# EAGLE design SurfaceEEG_E_V1.1 (EAGLE 7.5.0)
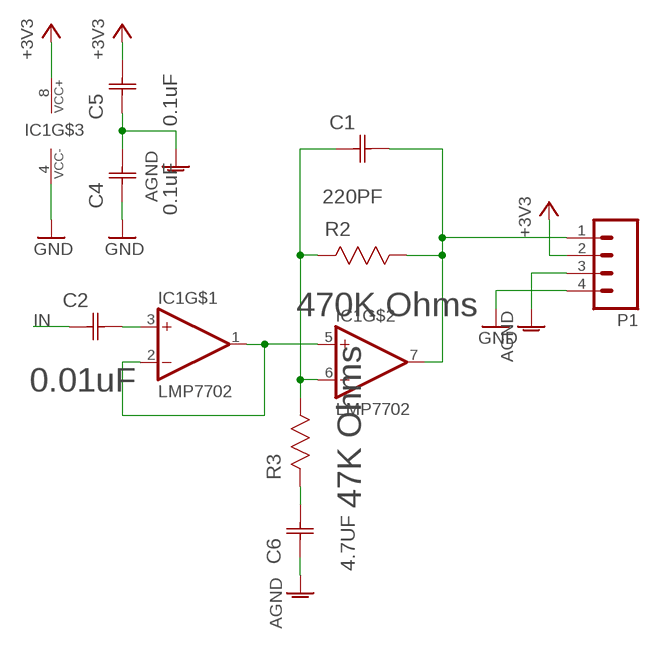
[diagram p0: schematic, sheet 1]

## Parts
C1  220PF  0603ZC221KAT2A  [CAPC1608X90N]
C2  0.01uF  C0402C103J3RACTU  [CAPC1005X60N]
C4  0.1uF  04023C104KAT2A  [CAPC1005X60N]
C5  0.1uF  04023C104KAT2A  [CAPC1005X60N]
C6  4.7UF  06036D475MAT2A  [CAPC1608X90N]
IC1  LMP7702  [VSSOP8]
P1  M04SMD  [1X04-SMD]
R2  470K Ohms  RC0603FR-07470KL  [RESC1608X60N]
R3  47K Ohms  RC0603FR-0747KL  [RESC1608X60N]

## Nets
+3V3: C5.1(C2) IC1.8(VCC+) P1.2
AGND: C4.1(C2) C5.2(C1) C6.1(C1) P1.3
GND: C4.2(C1) IC1.4(VCC-) P1.4
IN: C2.1(C1)
N$1: C2.2(C2) IC1.3(IN+)
N$2: C1.2(C2) IC1.7(OUT) P1.1 R2.1(R1)
N$4: C1.1(C1) IC1.6(IN-) R2.2(R2) R3.1(R1)
N$6: C6.2(C2) R3.2(R2)
SHIELD: IC1.1(OUT) IC1.2(IN-) IC1.5(IN+)

## Library data of the parts
C1 = (manufact)-capacitors-AVX-element14:0603ZC221KAT2A: Capacitor, 0603; MPN: 0603ZC221KAT2A; OC_FARNELL: -; OC_NEWARK: 41J1779; SUPPLIER: AVX; TOLERANCE: ±10%; VOLTAGERATING: 10V
C2 = (manufact)-Kemet-element14:C0402C103J3RACTU: CAPACITOR, 0402; MPN: C0402C103J3RACTU; OC_FARNELL: 1692285; OC_NEWARK: 78H4779; SUPPLIER: Kemet; TOLERANCE: ±5%; VOLTAGERATING: 25V
C4 C5 = (manufact)-capacitors-AVX-element14:04023C104KAT2A: Capacitor 0402; MPN: 04023C104KAT2A; OC_FARNELL: 1867948; OC_NEWARK: 37T9047; SUPPLIER: AVX; TOLERANCE: ±10%; VOLTAGERATING: 25V
C6 = (manufact)-capacitors-AVX-element14:06036D475MAT2A: Capacitor, 0603; MPN: 06036D475MAT2A; OC_FARNELL: 1740638; OC_NEWARK: 96M1296; SUPPLIER: AVX; TOLERANCE: ±20%; VOLTAGERATING: 6.3V
IC1 = (custom)-new-components:LMP7702: The library has been designed by Richard Magdycz <https://www.facebook.com/groups/eaglecadsoftUK>; MPN: LMP7702MM/NOPB
P1 = SparkFun-Connectors:M04: Header 4 Standard 4-pin 0.1" header. Use with straight break away headers (SKU : PRT-00116), right angle break away headers (PRT-00553), swiss pins (PRT-00743), machine pins (PRT-00117), and female headers (PRT-00115). Molex polarized connector foot print use with SKU : PRT-08231 with associated crimp pins and housings. 1MM SMD Version SKU: PRT-10208
R2 = (manufact)-resistors-YAGEO-element14:RC0603FR-07470KL: RESISTOR, 0603; MPN: RC0603FR-07470KL; OC_FARNELL: 1117267; OC_NEWARK: 68R0098; SUPPLIER: Yageo; TOLERANCE: ±1%; WATTAGE: 1/10 W
R3 = (manufact)-resistors-YAGEO-element14:RC0603FR-0747KL: RESISTOR, 0603; MPN: RC0603FR-0747KL; OC_FARNELL: 1117266; OC_NEWARK: 26M6759; SUPPLIER: Yageo; TOLERANCE: ±1%; WATTAGE: 1/10 W

## Board
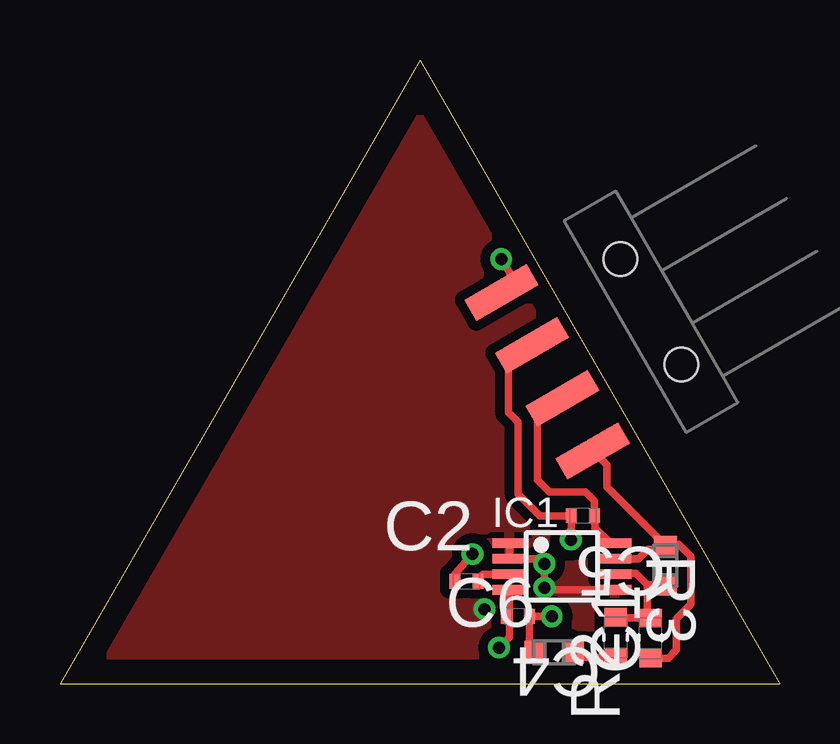
[diagram p1: board, top side]
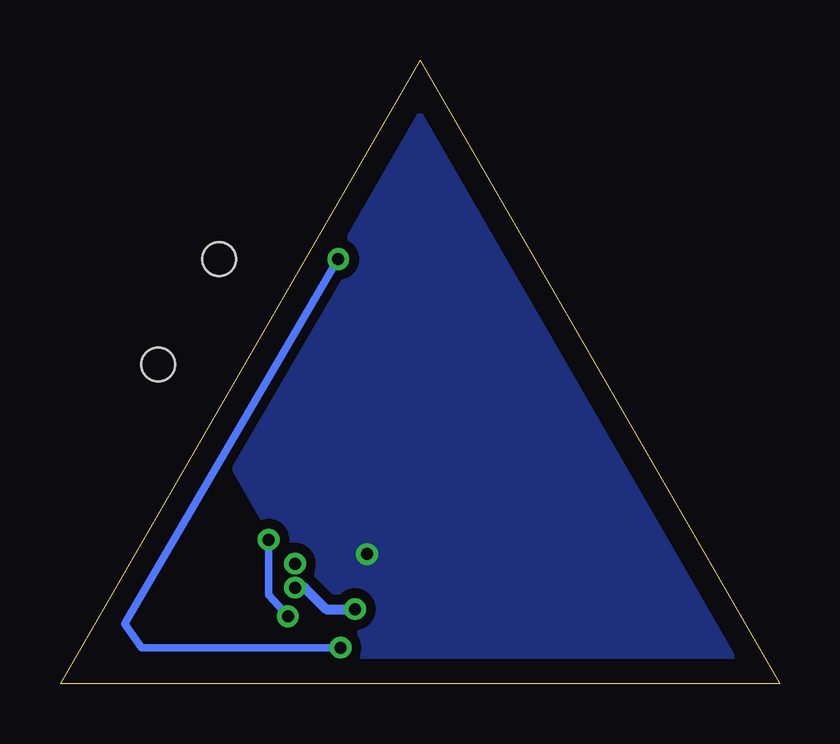
[diagram p2: board, bottom side, seen from below]

Size 30 x 26 mm. Coordinates in mm from the lower left corner, seen from the top.
Outline: 0,0 30,0 15,26 0,0
Copper layers (1*16): Top 0.035mm / dielectric 1.5mm / Bottom 0.035mm
Design rules "default": minimum track width 10mil, minimum drill 24mil, track to track 8mil, track to pad 8mil, pad to pad 8mil, via to via 8mil, smd to smd 8mil, copper to edge 40mil, drill to drill 8mil, minimum pad ring 10mil, minimum via ring 8mil, stop-mask expansion 4mil, vias tented up to drill 0mil, thermal gap 10mil

### Footprints (pad centres in the part's own frame; a part is rotated, then mirrored left to right if it is on the bottom)
CAPC1608X90N = smd 0.864 x 0.965: 1 -0.813,0; 2 0.813,0
CAPC1005X60N = smd 0.457 x 0.61: 1 -0.483,0; 2 0.483,0
VSSOP8 = smd 1.4 x 0.4: 1 -2.2,0.975; 2 -2.2,0.325; 3 -2.2,-0.325; 4 -2.2,-0.975; 5 2.2,-0.975; 6 2.2,-0.325; 7 2.2,0.325; 8 2.2,0.975
1X04-SMD = smd 1 x 3: 1 -3.81,5; 2 -1.27,5; 3 1.27,5; 4 3.81,5 | hole 1.4: -2.54,0; 2.54,0
RESC1608X60N = smd 0.762 x 0.94: 1 -0.838,0; 2 0.838,0

### Placement (x,y rotation side)
C1  25.24,4.92 90 top
C2  16.95,4.26 0 top
C4  19.1,2.8 180 top
C5  21.8,7 180 top
C6  20.6,1.3 0 top
IC1  20.93,4.88 0 top
P1  24.64,15.5 120 top
R2  24.62,1.9 90 top
R3  23.17,1.93 270 top

### Tracks (layer width: path | path; a pad name or v marks a point on that pad's centre or on a via)
+3V3
  Top 0.305: IC1.8 23.11,5.84 22.96,5.84 22.3,6.5 22.3,6.98 C5.1 22.28,7.62 21.9,8 20.4,8 19.9,8.5 19.9,10.86 P1.2
AGND  (via drill 0.5 pad 0.3)
  Top 0.305: v20.5,2.8 C4.1 19.58,1.71 C6.1 | v21.3,6 C5.2 20,7 19.1,7.9 19.1,10.9 18.7,11.3 18.7,13.12 P1.3
  Bottom 0.305: v20.5,2.8 21.3,3.7 v21.3,6
GND  (via drill 0.5 pad 0.3)
  Top 0.305: 18.6,2.68 C4.2 18.59,2.73 18.59,3.76 IC1.4 18.73,1.93 v18.3,1.5 | v18.4,17.7 19,16.7 P1.4
  Bottom 0.305: v18.3,1.5 26.6,1.5 27.3,2.5 v18.4,17.7
IN  (via drill 0.5 pad 0.3)
  Top 0.305: C2.1 16.47,4.57 v17.2,5.4 17.23,5.37 17.17,5.37
  pour Bottom (isolate 0.406): 15,24.7 1.1,0.6 17.9,0.6 23.4,10.2
N$1
  Top 0.305: IC1.3 17.63,4.55 C2.2
N$2
  Top 0.305: C1.2 | IC1.7 24.11,5.21 24.5,5.6 25.11,5.6 C1.2 | R2.1 25.36,1.06 25.7,1.4 25.7,2.7 26.3,3.3 26.3,5.3 25.8,5.8 25.31,5.8 | 25.31,5.8 C1.2 | 25.31,5.8 25.2,5.8 22.8,8.2 22.8,9.12 P1.1
N$4
  Top 0.305: 23.22,4.57 IC1.6 23.18,4.6 24,4.6 24.49,4.11 | C1.1 24.49,4.11 | 24.49,4.11 24.49,2.77 R2.2 23.2,2.74 R3.1
N$5  (via drill 0.5 pad 0.3)
  other vias: 20.2,5
N$6
  Top 0.305: R3.2 21.84,1.09 21.84,1.1 C6.2 21.3,1.7
SHIELD  (via drill 0.5 pad 0.25)
  Top 0.305: IC1.5 21,3.9 20.99,3.9 20.2,3.9 v20.2,4 | IC1.1 IC1.2 20,5.2 | 20.2,4.1 20.2,5
  Top 0.406: 20.2,5 20,5.2
  Bottom 0.406: v20.2,4 19.8,4 18.9,3.1 v17.7,3.1
  pour Top (isolate 0.406): 15,25.2 0.5,0.3 29.4,0.3